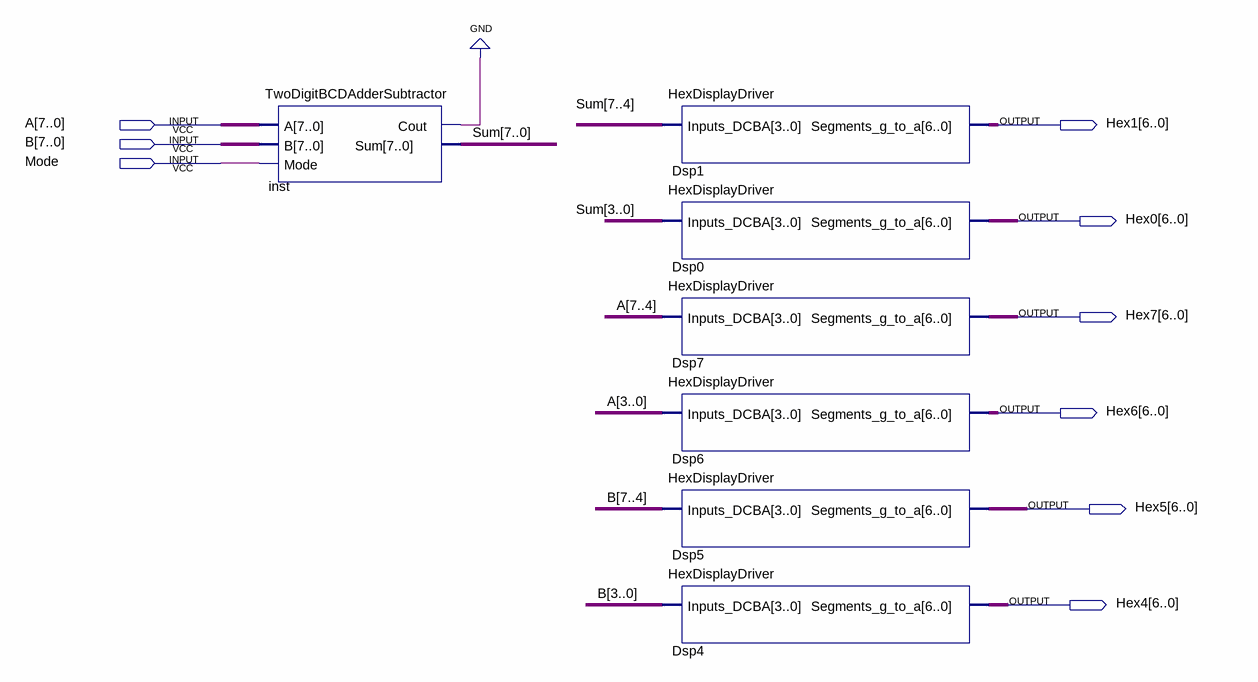
[diagram p0: schematic sheet]
// Quartus schematic TwoDigitBCDSymbolOnly.bdf as structural Verilog: 7 symbols, 9 pins
module TwoDigitBCDSymbolOnly (
  input  [7:0] A,
  input  [7:0] B,
  input  Mode,
  output [6:0] Hex1,
  output [6:0] Hex0,
  output [6:0] Hex7,
  output [6:0] Hex6,
  output [6:0] Hex5,
  output [6:0] Hex4
);

  wire inst_cout;
  wire [7:0] Sum;

  TwoDigitBCDAdderSubtractor inst (.A(A), .B(B), .Mode(Mode), .Cout(inst_cout), .Sum(Sum));
  HexDisplayDriver Dsp1 (.Inputs_DCBA(Sum[7:4]), .Segments_g_to_a(Hex1));
  HexDisplayDriver Dsp0 (.Inputs_DCBA(Sum[3:0]), .Segments_g_to_a(Hex0));
  HexDisplayDriver Dsp7 (.Inputs_DCBA(A[7:4]), .Segments_g_to_a(Hex7));
  HexDisplayDriver Dsp6 (.Inputs_DCBA(A[3:0]), .Segments_g_to_a(Hex6));
  HexDisplayDriver Dsp5 (.Inputs_DCBA(B[7:4]), .Segments_g_to_a(Hex5));
  HexDisplayDriver Dsp4 (.Inputs_DCBA(B[3:0]), .Segments_g_to_a(Hex4));
  // also tied to GND on the sheet: inst_cout
endmodule
